# EAGLE schematic TelephoneConnect_HoleAdjust (EAGLE 9.2.0)
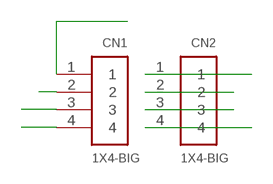
[diagram p0: schematic, sheet 1]

## Parts
CN1  1X4-BIG  [1X04-BIG]
CN2  1X4-BIG  [1X04-BIG]

## Nets
N$1: CN1.1
N$2: CN1.2
N$3: CN2.3
N$4: CN1.4
N$5: CN2.1
N$6: CN2.4
N$10: CN1.3
N$20: CN2.2

## Library data of the parts
CN1 CN2 = adafruit:1X4: 4-pin connector

## Net classes
0 default: width 1.016 mm, drill 0.076 mm